# Altium schematic sheet FPGA_Power.SchDoc
size A4; SheetNumber: 8; SheetTotal: 12
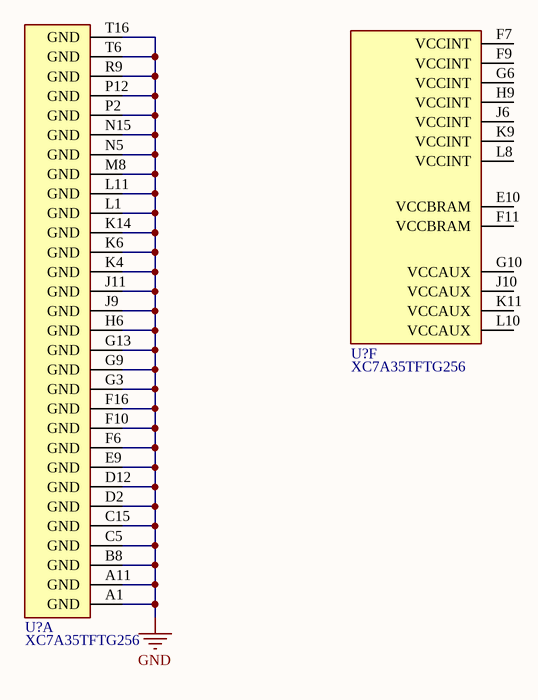
[diagram p0: FPGA_Power.SchDoc]

## Parts
(Parts that share a designator on the sheet are numbered #1, #2 ... from top to bottom, then left to right.)
U?#1  XC7A35TFTG256  [BGA-256]  (part F of 9)
U?#2  XC7A35TFTG256  [BGA-256]  (part A of 9)

## Nets
GND: U?#2.A1(GND) U?#2.A11(GND) U?#2.B8(GND) U?#2.C5(GND) U?#2.C15(GND) U?#2.D2(GND) U?#2.D12(GND) U?#2.E9(GND) U?#2.F6(GND) U?#2.F10(GND) U?#2.F16(GND) U?#2.G3(GND) U?#2.G9(GND) U?#2.G13(GND) U?#2.H6(GND) U?#2.J9(GND) U?#2.J11(GND) U?#2.K4(GND) U?#2.K6(GND) U?#2.K14(GND) U?#2.L1(GND) U?#2.L11(GND) U?#2.M8(GND) U?#2.N5(GND) U?#2.N15(GND) U?#2.P2(GND) U?#2.P12(GND) U?#2.R9(GND) U?#2.T6(GND) U?#2.T16(GND)

Not connected (* = marked no-connect by the designer): U?#1 E10(VCCBRAM) F7(VCCINT) F9(VCCINT) F11(VCCBRAM) G6(VCCINT) G10(VCCAUX) H9(VCCINT) J6(VCCINT) J10(VCCAUX) K9(VCCINT) K11(VCCAUX) L8(VCCINT) L10(VCCAUX)

## Library data of the parts
U?#1 U?#2 = XC7A35TFTG256: FPGA